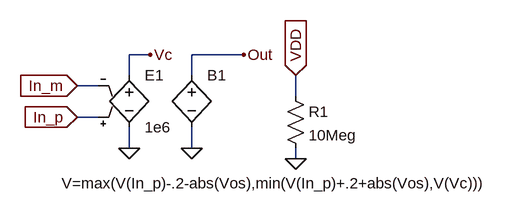
[diagram p0: schematic IdealComparator.asc]
IdealComparator.asc, the LTspice schematic file:
Version 4
SHEET 1 880 680
WIRE -160 -16 -192 -16
WIRE -16 -16 -96 -16
WIRE -192 16 -192 -16
WIRE -96 16 -96 -16
WIRE -240 32 -272 32
WIRE 64 48 64 16
WIRE -240 80 -272 80
WIRE -192 128 -192 96
WIRE -96 128 -96 96
WIRE 64 144 64 128
FLAG -192 128 0
FLAG -96 128 0
FLAG -160 -16 Vc
FLAG -272 32 In_m
IOPIN -272 32 In
FLAG -272 80 In_p
IOPIN -272 80 In
FLAG -16 -16 Out
FLAG 64 16 VDD
IOPIN 64 16 In
FLAG 64 144 0
SYMBOL e2 -192 0 R0
SYMATTR InstName E1
SYMATTR Value 1e6
SYMBOL bv -96 0 R0
WINDOW 3 -200 182 Left 0
SYMATTR Value V=max(V(In_p)-.2-abs(Vos),min(V(In_p)+.2+abs(Vos),V(Vc)))
SYMATTR InstName B1
SYMBOL res 48 32 R0
SYMATTR InstName R1
SYMATTR Value 10Meg

The netlist it stands for:
* IdealComparator.asc
E1 Vc 0 In_p In_m 1e6
B1 Out 0 V=max(V(In_p)-.2-abs(Vos),min(V(In_p)+.2+abs(Vos),V(Vc)))
R1 VDD 0 10Meg
.backanno
.end